# EAGLE design S-Puck-mcu (EAGLE 7.4.0)

## Sheet 1 of 2
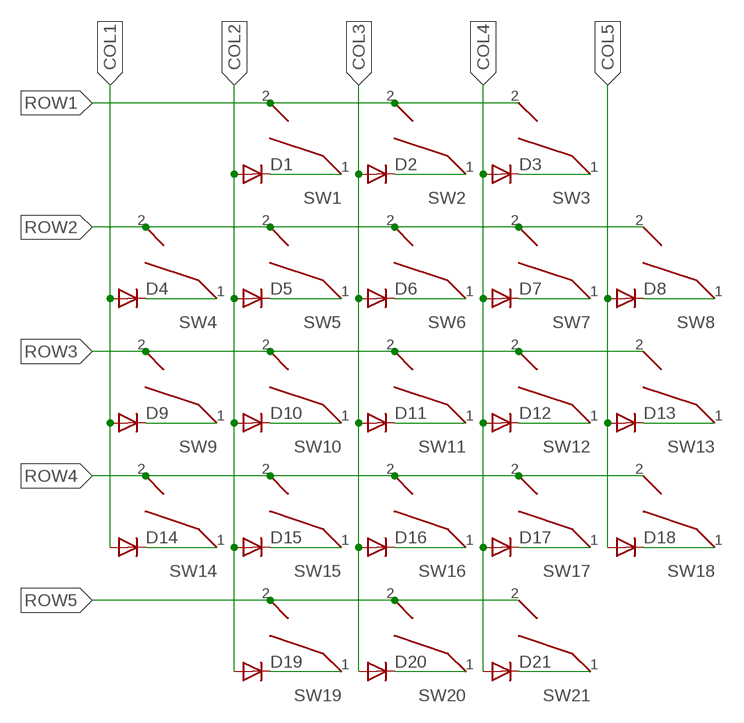
[diagram p0: schematic, sheet 1]

### Parts
D1  1N4148DO35-10  [DO35-10]
D2  1N4148DO35-10  [DO35-10]
D3  1N4148DO35-10  [DO35-10]
D4  1N4148DO35-10  [DO35-10]
D5  1N4148DO35-10  [DO35-10]
D6  1N4148DO35-10  [DO35-10]
D7  1N4148DO35-10  [DO35-10]
D8  1N4148DO35-10  [DO35-10]
D9  1N4148DO35-10  [DO35-10]
D10  1N4148DO35-10  [DO35-10]
D11  1N4148DO35-10  [DO35-10]
D12  1N4148DO35-10  [DO35-10]
D13  1N4148DO35-10  [DO35-10]
D14  1N4148DO35-10  [DO35-10]
D15  1N4148DO35-10  [DO35-10]
D16  1N4148DO35-10  [DO35-10]
D17  1N4148DO35-10  [DO35-10]
D18  1N4148DO35-10  [DO35-10]
D19  1N4148DO35-10  [DO35-10]
D20  1N4148DO35-10  [DO35-10]
D21  1N4148DO35-10  [DO35-10]
SW1  CHERRY_MX_WITH_FIXING_PINS  [MX1A-XXNW]
SW2  CHERRY_MX_WITH_FIXING_PINS  [MX1A-XXNW]
SW3  CHERRY_MX_WITH_FIXING_PINS  [MX1A-XXNW]
SW4  CHERRY_MX_WITH_FIXING_PINS  [MX1A-XXNW]
SW5  CHERRY_MX_WITH_FIXING_PINS  [MX1A-XXNW]
SW6  CHERRY_MX_WITH_FIXING_PINS  [MX1A-XXNW]
SW7  CHERRY_MX_WITH_FIXING_PINS  [MX1A-XXNW]
SW8  CHERRY_MX_WITH_FIXING_PINS  [MX1A-XXNW]
SW9  CHERRY_MX_WITH_FIXING_PINS  [MX1A-XXNW]
SW10  CHERRY_MX_WITH_FIXING_PINS  [MX1A-XXNW]
SW11  CHERRY_MX_WITH_FIXING_PINS  [MX1A-XXNW]
SW12  CHERRY_MX_WITH_FIXING_PINS  [MX1A-XXNW]
SW13  CHERRY_MX_WITH_FIXING_PINS  [MX1A-XXNW]
SW14  CHERRY_MX_WITH_FIXING_PINS  [MX1A-XXNW]
SW15  CHERRY_MX_WITH_FIXING_PINS  [MX1A-XXNW]
SW16  CHERRY_MX_WITH_FIXING_PINS  [MX1A-XXNW]
SW17  CHERRY_MX_WITH_FIXING_PINS  [MX1A-XXNW]
SW18  CHERRY_MX_WITH_FIXING_PINS  [MX1A-XXNW]
SW19  CHERRY_MX_WITH_FIXING_PINS  [MX1A-XXNW]
SW20  CHERRY_MX_WITH_FIXING_PINS  [MX1A-XXNW]
SW21  CHERRY_MX_WITH_FIXING_PINS  [MX1A-XXNW]

### Nets
COL1: D4.A D9.A D14.A ; also sheet 2
COL2: D1.A D5.A D10.A D15.A D19.A ; also sheet 2
COL3: D2.A D6.A D11.A D16.A D20.A ; also sheet 2
COL4: D3.A D7.A D12.A D17.A D21.A ; also sheet 2
COL5: D8.A D13.A D18.A ; also sheet 2
N$1: D1.C SW1.1
N$2: D2.C SW2.1
N$3: D3.C SW3.1
N$4: D4.C SW4.1
N$5: D5.C SW5.1
N$6: D6.C SW6.1
N$7: D7.C SW7.1
N$8: D8.C SW8.1
N$9: D9.C SW9.1
N$10: D10.C SW10.1
N$11: D11.C SW11.1
N$12: D12.C SW12.1
N$13: D13.C SW13.1
N$14: D14.C SW14.1
N$15: D15.C SW15.1
N$16: D16.C SW16.1
N$17: D17.C SW17.1
N$18: D18.C SW18.1
N$19: D19.C SW19.1
N$20: D20.C SW20.1
N$21: D21.C SW21.1
ROW1: SW1.2 SW2.2 SW3.2 ; also sheet 2
ROW2: SW4.2 SW5.2 SW6.2 SW7.2 SW8.2 ; also sheet 2
ROW3: SW9.2 SW10.2 SW11.2 SW12.2 SW13.2 ; also sheet 2
ROW4: SW14.2 SW15.2 SW16.2 SW17.2 SW18.2 ; also sheet 2
ROW5: SW19.2 SW20.2 SW21.2 ; also sheet 2

## Sheet 2 of 2: Controller
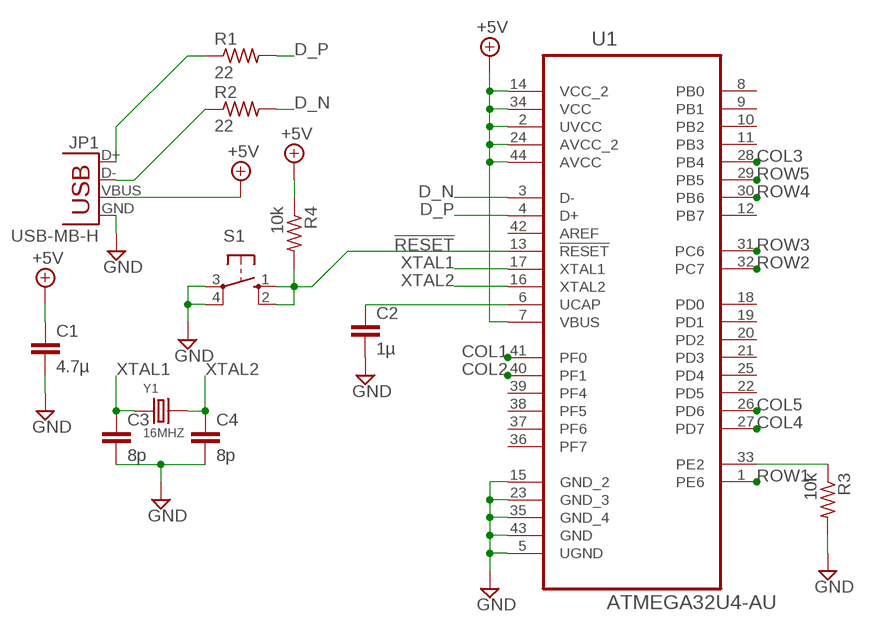
[diagram p1: schematic, sheet 2]

### Parts
C1  4.7µ  C-EUC0805K  [C0805K]
C2  1µ  C-EUC0805K  [C0805K]
C3  8p  C-EUC0805K  [C0805K]
C4  8p  C-EUC0805K  [C0805K]
JP1  USB-MB-H  [USB-MB-H]
R1  22  R-US_R0805W  [R0805W]
R2  22  R-US_R0805W  [R0805W]
R3  10k  R-US_R0805W  [R0805W]
R4  10k  R-US_R0805W  [R0805W]
S1  10-XX  [B3F-10XX]
U1  ATMEGA32U4-AU  [QFP80P1200X1200X120-44N]
Y1  16MHZ  SMD-CRYSTAL-16MHZ-8PF-20PPM-40R(2P-5.0X3.2MM)  [X2-SMD-5.0X3.2X1.3MM]

### Nets
!RESET!: R4.2 S1.1(S) S1.2(S1) U1.13(!RESET!)
+5V: C1.1 JP1.VBUS R4.1 U1.2(UVCC) U1.7(VBUS) U1.14(VCC_2) U1.24(AVCC_2) U1.34(VCC) U1.44(AVCC)
COL1: U1.41(PF0) ; also sheet 1
COL2: U1.40(PF1) ; also sheet 1
COL3: U1.28(PB4) ; also sheet 1
COL4: U1.27(PD7) ; also sheet 1
COL5: U1.26(PD6) ; also sheet 1
D_N: R2.2 U1.3(D-)
D_P: R1.2 U1.4(D+)
GND: C1.2 C2.2 C3.2 C4.2 JP1.GND R3.2 S1.3(P) S1.4(P1) U1.5(UGND) U1.15(GND_2) U1.23(GND_3) U1.35(GND_4) U1.43(GND)
N$22: JP1.D+ R1.1
N$23: JP1.D- R2.1
N$24: R3.1 U1.33(PE2)
N$25: C2.1 U1.6(UCAP)
ROW1: U1.1(PE6) ; also sheet 1
ROW2: U1.32(PC7) ; also sheet 1
ROW3: U1.31(PC6) ; also sheet 1
ROW4: U1.30(PB6) ; also sheet 1
ROW5: U1.29(PB5) ; also sheet 1
XTAL1: C3.1 U1.17(XTAL1) Y1.1
XTAL2: C4.1 U1.16(XTAL2) Y1.2
Unconnected: U1.8(PB0) U1.9(PB1) U1.10(PB2) U1.11(PB3) U1.12(PB7) U1.18(PD0) U1.19(PD1) U1.20(PD2) U1.21(PD3) U1.22(PD5) U1.25(PD4) U1.36(PF7) U1.37(PF6) U1.38(PF5) U1.39(PF4) U1.42(AREF)

## Library data of the parts
C1-C4 = resistor:C-EU: CAPACITOR, European symbol
D1-D21 = diode:1N4148: DIODE high speed (Philips)
JP1 = SparkFun-Connectors:USB: USB Connectors USB-B-PTH is fully proven SKU : PRT-00139/CONN-08278 USB-miniB is fully proven SKU : PRT-00587 USB-A-PCB is untested. USB-A-H is throughly reviewed, but untested. Spark Fun Electronics SKU : PRT-00437 USB-B-SMT is throughly reviewed, but untested. Needs silkscreen touching up. USB-A-S has not been used/tested USB-MB-H has not been used/tested USB-MICROB has been used. CONN-09505
R1-R4 = resistor:R-US_: RESISTOR, American symbol
S1 = switch-omron:10-XX: OMRON SWITCH; MPN: B3F-1000; OC_FARNELL: 176432; OC_NEWARK: 36M3542
SW1-SW21 = Cherry_MX_v7.0:CHERRY_MX
U1 = ATMEGA32U4:ATMEGA32U4-AU: 8-bit Microcontroller with ISP Flash and USB Controller; MPN: ATMEGA32U4-AU; OC_FARNELL: 1748525; OC_NEWARK: 68T2838; PACKAGE: TQFP-44; SUPPLIER: Atmel
Y1 = Seeed-Crystal Oscillator-2016:SMD-CRYSTAL-16MHZ-8PF-20PPM-40R(2P-5.0X3.2MM): 306010054; MPN: X053201602002

## Board
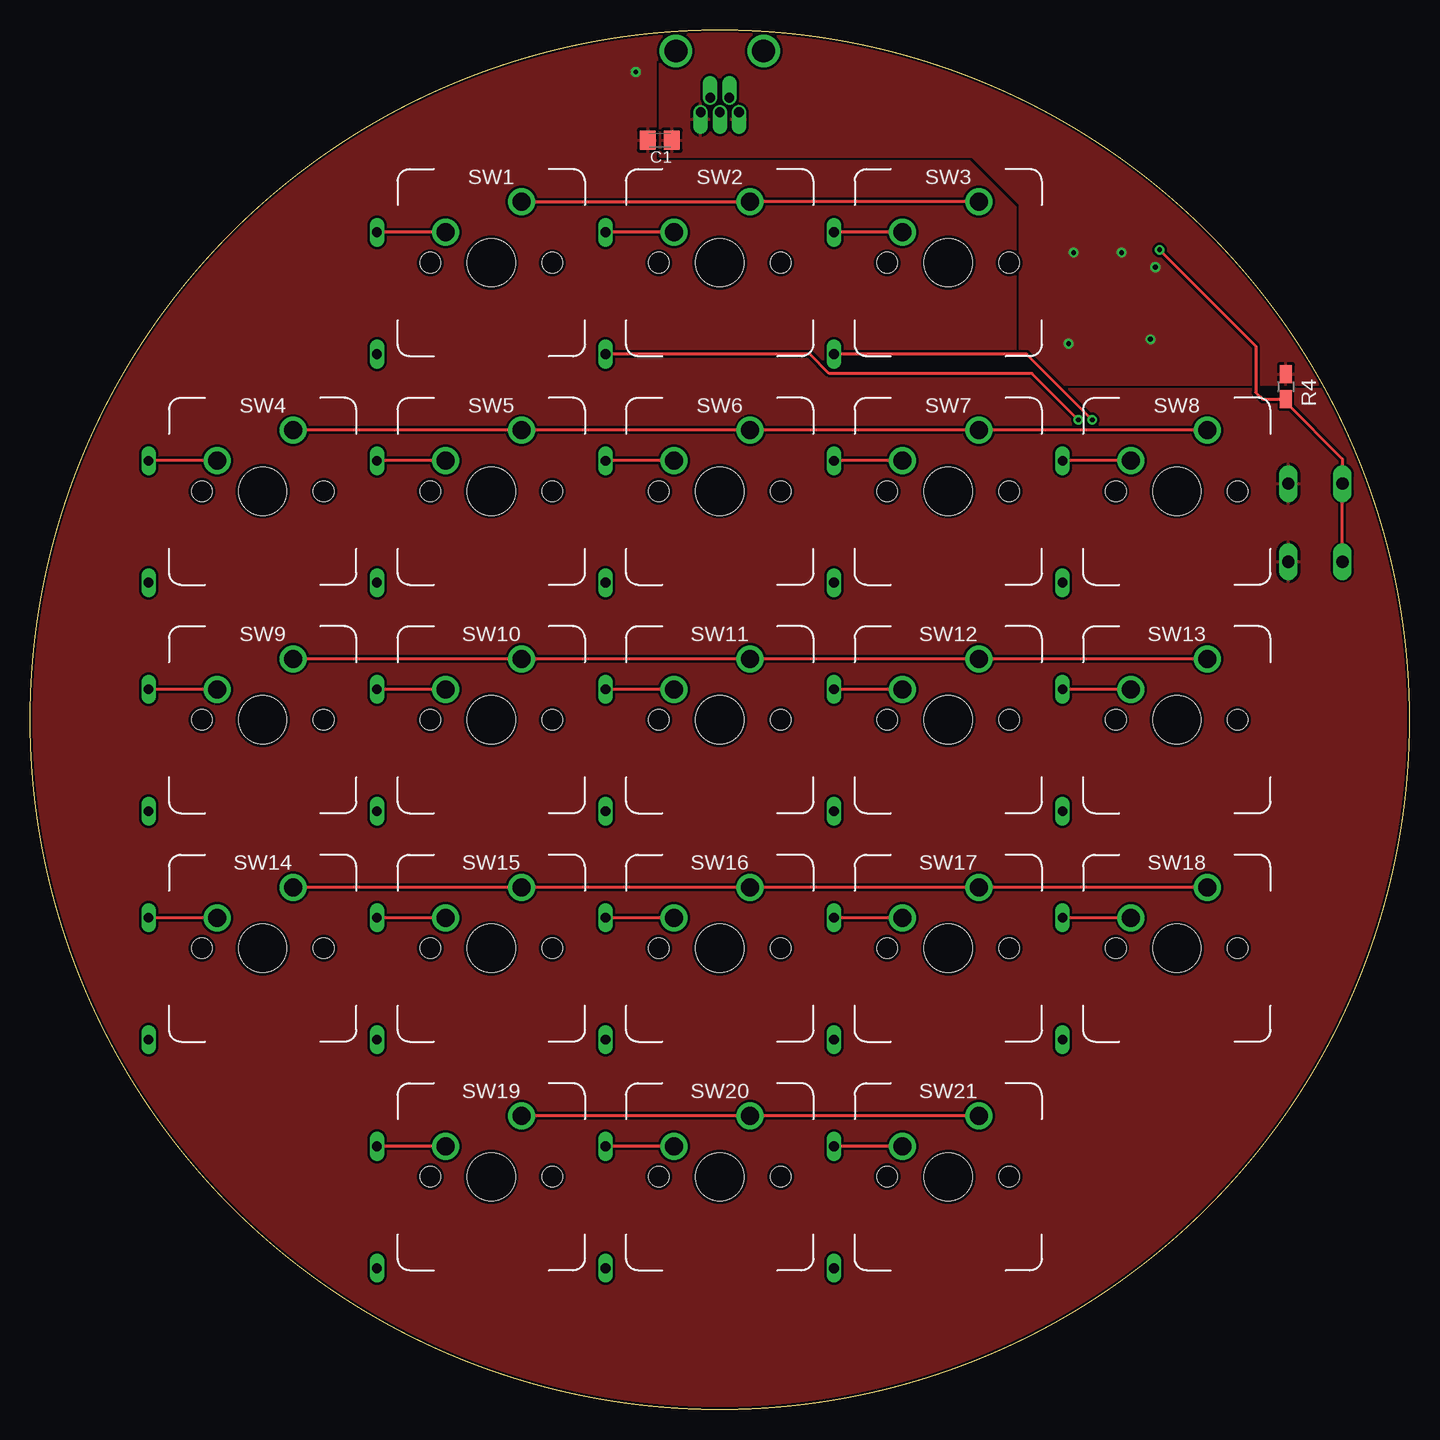
[diagram p2: board, top side]
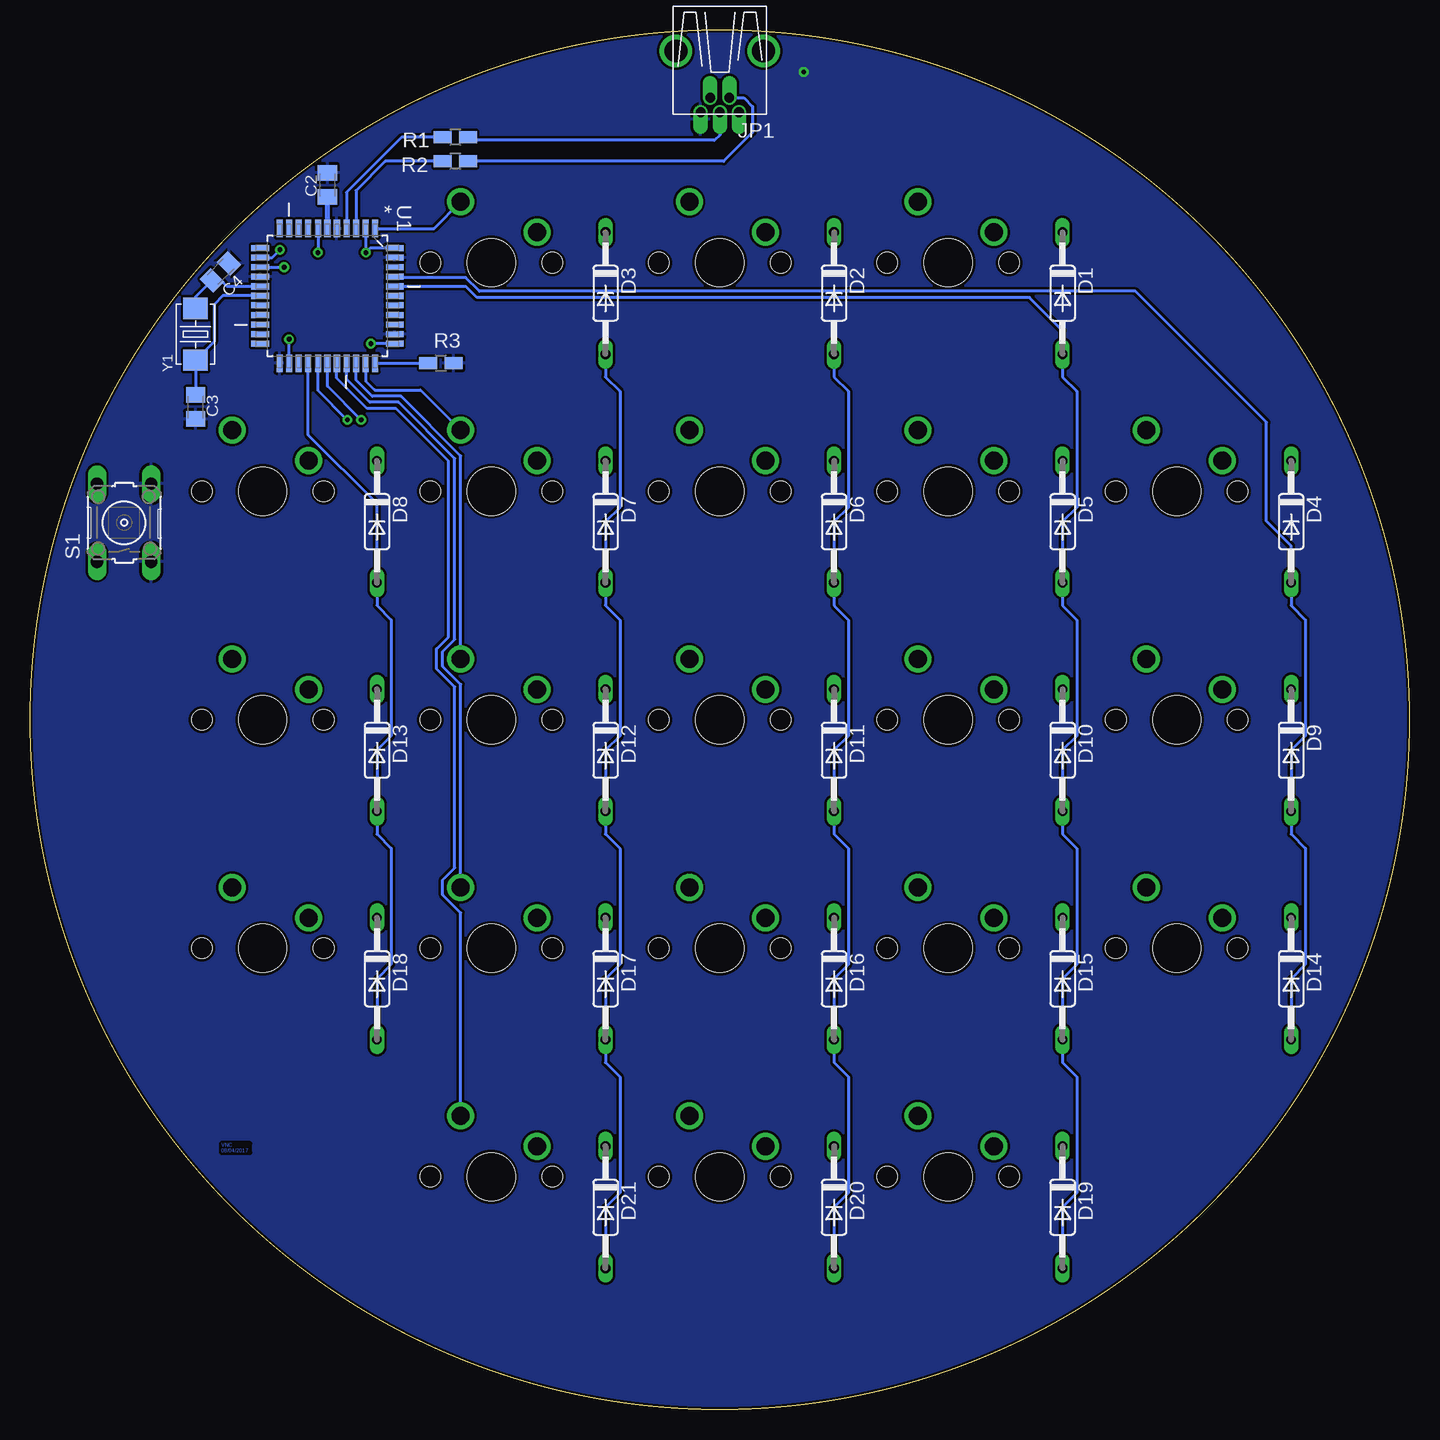
[diagram p3: board, bottom side, seen from below]

Size 115 x 115 mm. Coordinates in mm from the lower left corner, seen from the top.
Outline: circle at 57.5,57.5 radius 57.5
Copper layers (1*16): Top 0.035mm / dielectric 1.5mm / Bottom 0.035mm
Design rules "default *": minimum track width 10mil, minimum drill 24mil, track to track 8mil, track to pad 8mil, pad to pad 8mil, via to via 8mil, smd to smd 8mil, copper to edge 10mil, drill to drill 8mil, minimum pad ring 8mil, minimum via ring 8mil, stop-mask expansion 4mil, vias tented up to drill 0mil, thermal gap 10mil

### Footprints (pad centres in the part's own frame; a part is rotated, then mirrored left to right if it is on the bottom)
C0805K = smd 1.3 x 1.6: 1 -1,0; 2 1,0
DO35-10 = drill 0.813 long: A 5.08,0; C -5.08,0
USB-MB-H = drill 0.8 offset: D+ 5.1,0; D- 3.9,0.8; GND 5.1,-1.6; ID 3.9,-0.8; VBUS 5.1,1.6 | drill 1.9: P$6 0,-3.65; P$7 0,3.65
R0805W = smd 1.5 x 1: 1 -1.052,0; 2 1.052,0
B3F-10XX = drill 1.016 long: 1 -3.251,2.261; 2 3.251,2.261; 3 -3.251,-2.261; 4 3.251,-2.261
MX1A-XXNW = drill 1.5: 1 -3.81,2.54; 2 2.54,5.08 | hole 4: 0,0 | hole 1.7: -5.08,0; 5.08,0
QFP80P1200X1200X120-44N = smd 1.473 x 0.508: 1 -5.613,3.988; 2 -5.613,3.2; 3 -5.613,2.388; 4 -5.613,1.6; 5 -5.613,0.787; 6 -5.613,0; 7 -5.613,-0.787; 8 -5.613,-1.6; 9 -5.613,-2.388; 10 -5.613,-3.2; 11 -5.613,-3.988; 23 5.613,-3.988; 24 5.613,-3.2; 25 5.613,-2.388; 26 5.613,-1.6; 27 5.613,-0.787; 28 5.613,0; 29 5.613,0.787; 30 5.613,1.6; 31 5.613,2.388; 32 5.613,3.2; 33 5.613,3.988 | smd 0.508 x 1.473: 12 -3.988,-5.613; 13 -3.2,-5.613; 14 -2.388,-5.613; 15 -1.6,-5.613; 16 -0.787,-5.613; 17 0,-5.613; 18 0.787,-5.613; 19 1.6,-5.613; 20 2.388,-5.613; 21 3.2,-5.613; 22 3.988,-5.613; 34 3.988,5.613; 35 3.2,5.613; 36 2.388,5.613; 37 1.6,5.613; 38 0.787,5.613; 39 0,5.613; 40 -0.787,5.613; 41 -1.6,5.613; 42 -2.388,5.613; 43 -3.2,5.613; 44 -3.988,5.613
X2-SMD-5.0X3.2X1.3MM = smd 1.778 x 2.032: 1 -2.159,0; 2 2.159,0

### Placement (x,y rotation side)
C1  52.5,105.81 180 top
C2  90.2,102.09 90 bottom
C3  101.2,83.57 270 bottom
C4  99.12,94.84 45 bottom
D1  28.93,93.06 270 bottom
D2  47.98,93.06 270 bottom
D3  67.03,93.06 270 bottom
D4  9.88,74.01 270 bottom
D5  28.93,74.01 270 bottom
D6  47.98,74.01 270 bottom
D7  67.03,74.01 270 bottom
D8  86.08,74.01 270 bottom
D9  9.88,54.96 270 bottom
D10  28.93,54.96 270 bottom
D11  47.98,54.96 270 bottom
D12  67.03,54.96 270 bottom
D13  86.08,54.96 270 bottom
D14  9.88,35.91 270 bottom
D15  28.93,35.91 270 bottom
D16  47.98,35.91 270 bottom
D17  67.03,35.91 270 bottom
D18  86.08,35.91 270 bottom
D19  28.93,16.86 270 bottom
D20  47.98,16.86 270 bottom
D21  67.03,16.86 270 bottom
JP1  57.5,113.25 270 bottom
R1  79.55,106.06 180 bottom
R2  79.55,104.06 180 bottom
R3  80.75,87.22 0 bottom
R4  104.69,85.27 270 top
S1  107.15,73.92 90 bottom
SW1  38.45,95.6 0 top
SW2  57.5,95.6 0 top
SW3  76.55,95.6 0 top
SW4  19.4,76.55 0 top
SW5  38.45,76.55 0 top
SW6  57.5,76.55 0 top
SW7  76.55,76.55 0 top
SW8  95.6,76.55 0 top
SW9  19.4,57.5 0 top
SW10  38.45,57.5 0 top
SW11  57.5,57.5 0 top
SW12  76.55,57.5 0 top
SW13  95.6,57.5 0 top
SW14  19.4,38.45 0 top
SW15  38.45,38.45 0 top
SW16  57.5,38.45 0 top
SW17  76.55,38.45 0 top
SW18  95.6,38.45 0 top
SW19  38.45,19.4 0 top
SW20  57.5,19.4 0 top
SW21  76.55,19.4 0 top
U1  90.2,92.84 270 bottom
Y1  101.2,89.64 90 bottom

### Tracks (layer width: path | path; a pad name or v marks a point on that pad's centre or on a via)
!RESET!  (via drill 0.4)
  Top 0.254: S1.1 S1.2 109.41,79.25 104.69,83.97 R4.2 102.75,84.22 102.18,84.79 102.18,88.66 v94.16,96.68
  Bottom 0.254: U1.13 94.81,96.03 v94.16,96.68
+5V  (via drill 0.4)
  Bottom 0.254: U1.14 v93.82,95.22 | U1.24 v93.41,89.22 | U1.34 v86.59,88.85 | U1.2 v87,96.45 86.63,96.82 U1.44 | U1.7 v90.99,96.45
  pour Top: 52.5,116.5 52.5,104.5 73.5,104.5 78.5,104.5 82.5,100.5 82.5,85.5 110.5,85.5 110.5,116.5
COL1
  Bottom 0.254: D14.A 9.88,35.91 8.68,37.11 8.68,46.78 9.88,47.98 D9.A 9.88,54.96 8.68,56.16 8.68,65.83 9.88,67.03 D4.A 9.88,71.98 11.94,74.05 11.94,82.3 22.85,93.22 77.53,93.22 78.69,94.37 84.59,94.37 U1.41
COL2
  Bottom 0.254: D19.A 28.93,16.86 27.73,18.05 27.73,27.73 28.93,28.93 D15.A 28.93,35.91 27.73,37.11 27.73,46.78 28.93,47.98 D10.A 28.93,54.96 27.73,56.16 27.73,65.83 28.93,67.03 D5.A 28.93,74.01 27.73,75.2 27.73,84.88 28.93,86.08 D1.A 28.93,89.94 31.68,92.7 77.75,92.7 78.66,93.62 U1.40
COL3  (via drill 0.4)
  Top 0.254: v87.4,82.5 83.53,86.38 66.61,86.38 65.01,87.98 D2.A
  Bottom 0.254: D2.A 47.98,86.08 46.78,84.88 46.78,75.2 47.98,74.01 D6.A 47.98,67.03 46.78,65.83 46.78,56.16 47.98,54.96 D11.A 47.98,47.98 46.78,46.78 46.78,37.11 47.98,35.91 D16.A 47.98,28.93 46.78,27.73 46.78,18.05 47.98,16.86 D20.A | v87.4,82.5 90.2,85.31 U1.28
COL4  (via drill 0.4)
  Top 0.254: v88.55,82.5 83.07,87.98 D3.A
  Bottom 0.254: D3.A 67.03,86.08 65.83,84.88 65.83,75.2 67.03,74.01 D7.A 67.03,67.03 65.83,65.83 65.83,56.16 67.03,54.96 D12.A 67.03,47.98 65.83,46.78 65.83,37.11 67.03,35.91 D17.A 67.03,28.93 65.83,27.73 65.83,18.05 67.03,16.86 D21.A | v88.55,82.5 90.99,84.94 U1.27
COL5
  Bottom 0.254: D18.A 86.08,35.91 84.88,37.11 84.88,46.78 86.08,47.98 D13.A 86.08,54.96 84.88,56.16 84.88,65.83 86.08,67.03 D8.A 86.08,75.5 91.81,81.23 U1.26
D_N
  Bottom 0.254: R2.2 85.38,104.06 87.82,101.61 U1.3
D_P
  Bottom 0.254: R1.2 84.02,106.06 88.61,101.47 U1.4
GND  (via drill 0.4)
  other vias: 50.5,111.5
  pour Bottom: -0.5,-0.5 115.5,-0.5 115.5,115.5 -0.5,115.5
  pour Top (rank 2): 56.5,-0.5 115.5,-0.5 115.5,59.5 115.5,115.5 56.5,115.5 -0.5,115.5 -0.5,56.5 -0.5,-0.5
N$1
  Top 0.254: SW1.1 D1.C
N$2
  Top 0.254: SW2.1 D2.C
N$3
  Top 0.254: SW3.1 D3.C
N$4
  Top 0.254: SW4.1 D4.C
N$5
  Top 0.254: SW5.1 D5.C
N$6
  Top 0.254: SW6.1 D6.C
N$7
  Top 0.254: SW7.1 D7.C
N$8
  Top 0.254: SW8.1 D8.C
N$9
  Top 0.254: SW9.1 D9.C
N$10
  Top 0.254: SW10.1 D10.C
N$11
  Top 0.254: SW11.1 D11.C
N$12
  Top 0.254: SW12.1 D12.C
N$13
  Top 0.254: SW13.1 D13.C
N$14
  Top 0.254: SW14.1 D14.C
N$15
  Top 0.254: SW15.1 D15.C
N$16
  Top 0.254: SW16.1 D16.C
N$17
  Top 0.254: SW17.1 D17.C
N$18
  Top 0.254: SW18.1 D18.C
N$19
  Top 0.254: SW19.1 D19.C
N$20
  Top 0.254: SW20.1 D20.C
N$21
  Top 0.254: SW21.1 D21.C
N$22
  Bottom 0.254: JP1.D+ 57.5,106.25 57.94,105.81 78.49,105.81 R1.1
N$23
  Bottom 0.254: JP1.D- 55.49,109.35 54.76,108.62 54.76,106.47 57.17,104.06 R2.1
N$24
  Bottom 0.254: U1.33 R3.1
N$25
  Bottom 0.406: U1.6 C2.1
ROW1
  Top 0.254: SW1.2 SW2.2 SW3.2
  Bottom 0.254: U1.1 81.32,98.45 SW3.2
ROW2
  Top 0.254: SW8.2 SW7.2 SW6.2 SW5.2 SW4.2
  Bottom 0.254: U1.32 87,85.72 86.27,84.98 82.44,84.98 SW7.2
ROW3
  Top 0.254: SW13.2 SW12.2 SW11.2 SW10.2 SW9.2
  Bottom 0.254: SW12.2 79.09,79.5 84.07,84.47 86.47,84.47 87.82,85.82 U1.31
ROW4
  Top 0.254: SW14.2 SW15.2 SW16.2 SW17.2 SW18.2
  Bottom 0.254: SW17.2 79.09,60.45 80.6,61.95 80.6,63.2 79.6,64.2 79.6,79.28 84.28,83.97 86.69,83.97 88.61,85.89 U1.30
ROW5
  Top 0.254: SW21.2 SW20.2 SW19.2
  Bottom 0.254: SW21.2 79.09,41.4 80.6,42.91 80.6,44.15 79.6,45.15 79.6,60.23 81.11,61.74 81.11,63.41 80.11,64.42 80.11,79.08 84.49,83.45 86.89,83.45 89.42,85.98 U1.29
XTAL1
  Bottom 0.254: C3.1 Y1.1 99.66,89.02 99.66,92.09 98.92,92.84 U1.17
XTAL2
  Bottom 0.254: Y1.2 101.2,92.77 C4.1 99.09,94.14 98.57,93.62 U1.16

### Text on the board
Bottom: VNC / 08/04/2017
bDocu: S-Puck